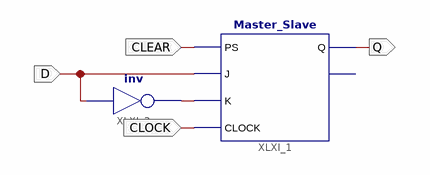
[diagram p0: schematic sheet 1]
// Xilinx ISE schematic D_FF.sch (artix7) as structural Verilog: 2 symbols, 4 ports
module D_FF (
  input  CLEAR,
  input  D,
  input  CLOCK,
  output Q
);

  wire XLXN_1;

  Master_Slave XLXI_1 (.CLOCK(CLOCK), .J(D), .K(XLXN_1), .PS(CLEAR), .Q(Q));  // open: Qb
  not XLXI_2 (XLXN_1, D);
endmodule
